# EAGLE design R303D (EAGLE 6.6.0)
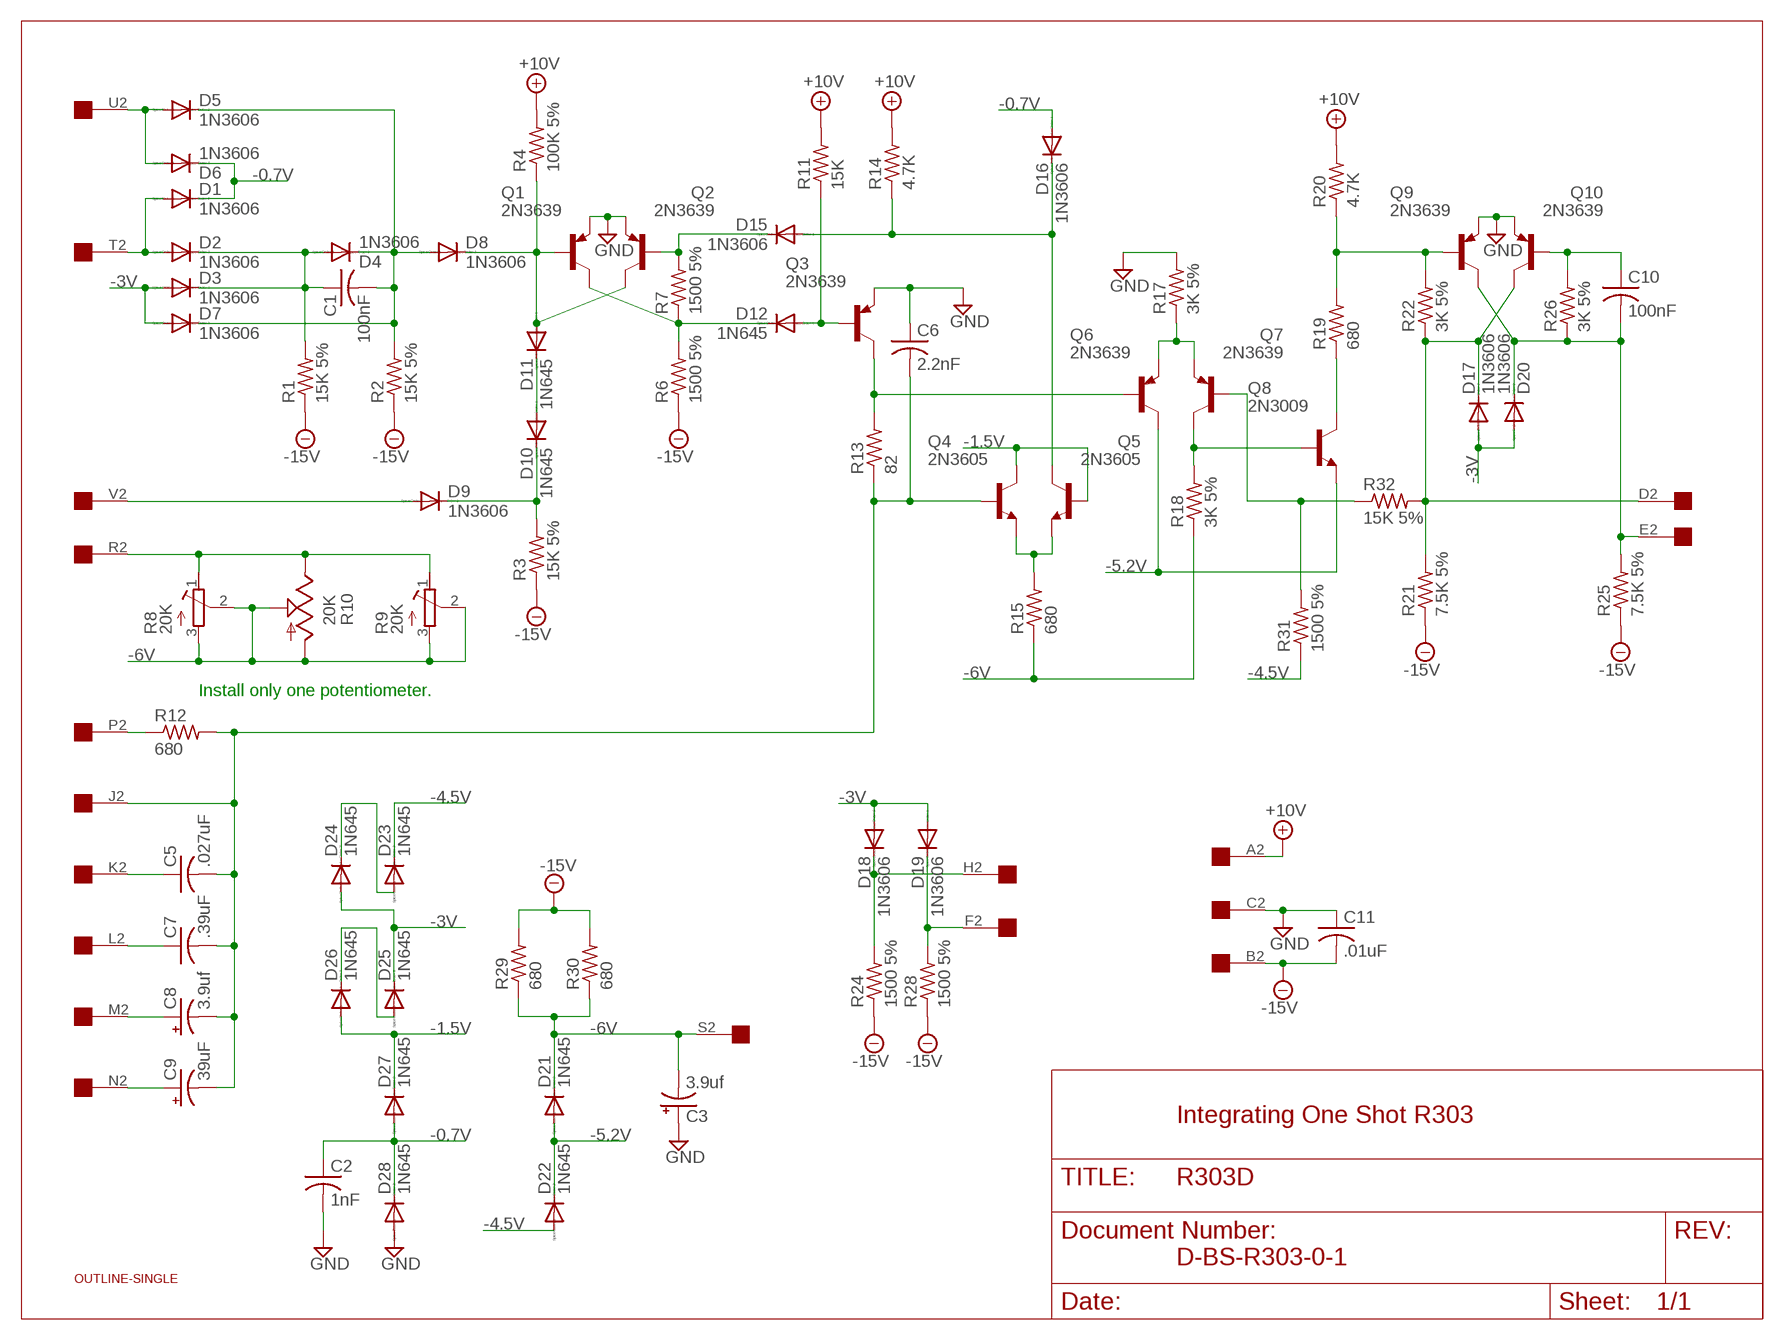
[diagram p0: schematic, sheet 1]

## Parts
C1  100nF  C-US075-032X103  [C075-032X103]
C2  1nF  C-US050-025X075  [C050-025X075]
C3  3.9uf  CPOL-USE12-4AXIAL  [E12-4]
C5  .027uF  C-US225-062X268  [C225-062X268]
C6  2.2nF  C-US050-025X075  [C050-025X075]
C7  .39uF  C-US325-137X374  [C325-137X374]
C8  3.9uf  CPOL-USE12-4AXIAL  [E12-4]
C9  39uF  CPOL-USE15-5AXIAL  [E15-5]
C10  100nF  C-US075-032X103  [C075-032X103]
C11  .01uF  C-US075-032X103  [C075-032X103]
D1  1N3606  1N4148DO35-10  [DO35-10]
D2  1N3606  1N4148DO35-10  [DO35-10]
D3  1N3606  1N4148DO35-10  [DO35-10]
D4  1N3606  1N4148DO35-10  [DO35-10]
D5  1N3606  1N4148DO35-10  [DO35-10]
D6  1N3606  1N4148DO35-10  [DO35-10]
D7  1N3606  1N4148DO35-10  [DO35-10]
D8  1N3606  1N4148DO35-10  [DO35-10]
D9  1N3606  1N4148DO35-10  [DO35-10]
D10  1N645  1N4148DO35-10  [DO35-10]
D11  1N645  1N4148DO35-10  [DO35-10]
D12  1N645  1N4148DO35-10  [DO35-10]
D15  1N3606  1N4148DO35-10  [DO35-10]
D16  1N3606  1N4148DO35-10  [DO35-10]
D17  1N3606  1N4148DO35-10  [DO35-10]
D18  1N3606  1N4148DO35-10  [DO35-10]
D19  1N3606  1N4148DO35-10  [DO35-10]
D20  1N3606  1N4148DO35-10  [DO35-10]
D21  1N645  1N4148DO35-10  [DO35-10]
D22  1N645  1N4148DO35-10  [DO35-10]
D23  1N645  1N4148DO35-10  [DO35-10]
D24  1N645  1N4148DO35-10  [DO35-10]
D25  1N645  1N4148DO35-10  [DO35-10]
D26  1N645  1N4148DO35-10  [DO35-10]
D27  1N645  1N4148DO35-10  [DO35-10]
D28  1N645  1N4148DO35-10  [DO35-10]
Q1  2N3639  2N2904  [TO39]
Q2  2N3639  2N2904  [TO39]
Q3  2N3639  2N2904  [TO39]
Q4  2N3605  2N2102  [TO5]
Q5  2N3605  2N2102  [TO5]
Q6  2N3639  2N2904  [TO39]
Q7  2N3639  2N2904  [TO39]
Q8  2N3009  2N2102  [TO5]
Q9  2N3639  2N2904  [TO39]
Q10  2N3639  2N2904  [TO39]
R1  15K 5%  R-US_0207/10  [0207/10]
R2  15K 5%  R-US_0207/10  [0207/10]
R3  15K 5%  R-US_0207/10  [0207/10]
R4  100K 5%  R-US_0207/10  [0207/10]
R6  1500 5%  R-US_0207/10  [0207/10]
R7  1500 5%  R-US_0207/10  [0207/10]
R8  20K  R-TRIMM43P  [RTRIM43P]
R9  20K  275P  [3006Y]
R10  20K  TRIM_US-B25P  [B25P]
R11  15K  R-US_0207/10  [0207/10]
R12  680  R-US_0207/10  [0207/10]
R13  82  R-US_0207/10  [0207/10]
R14  4.7K  R-US_0207/10  [0207/10]
R15  680  R-US_0207/10  [0207/10]
R17  3K 5%  R-US_0207/10  [0207/10]
R18  3K 5%  R-US_0207/10  [0207/10]
R19  680  R-US_0207/10  [0207/10]
R20  4.7K  R-US_0207/10  [0207/10]
R21  7.5K 5%  R-US_0207/10  [0207/10]
R22  3K 5%  R-US_0207/10  [0207/10]
R24  1500 5%  R-US_0207/10  [0207/10]
R25  7.5K 5%  R-US_0207/10  [0207/10]
R26  3K 5%  R-US_0207/10  [0207/10]
R28  1500 5%  R-US_0207/10  [0207/10]
R29  680  R-US_0207/10  [0207/10]
R30  680  R-US_0207/10  [0207/10]
R31  1500 5%  R-US_0207/10  [0207/10]
R32  15K 5%  R-US_0207/10  [0207/10]
U$1  OUTLINE-SINGLE  [SINGLE]
U$2  EDGE-1  [EDGE-CON1]

## Nets
+10V [Supply]: R4.2 R11.2 R14.2 R20.2 U$2.A2
-0.7V: C2.1 D1.C D6.C D16.A D27.A D28.C
-1.5V [Supply]: D26.A D27.C Q4.3(C) Q5.2(B)
-3V [Supply]: D3.A D7.A D17.A D18.A D19.A D20.A D24.A D25.C
-4.5V [Supply]: D22.A D23.C R31.1
-5.2V [Supply]: D21.A D22.C Q6.3(C) Q8.1(E)
-6V: C3.- D21.C R8.2(S) R8.3(A) R9.2(S) R9.3(E) R10.A R10.S R15.1 R18.1 R29.1 R30.1 U$2.S2
-15V [Supply]: C11.2 R1.1 R2.1 R3.1 R6.1 R21.1 R24.1 R25.1 R28.1 R29.2 R30.2 U$2.B2
GND [Supply]: C2.2 C3.+ C6.1 C11.1 D28.A Q1.1(E) Q2.1(E) Q3.1(E) Q9.1(E) Q10.1(E) R17.2 U$2.C2
N$1: D1.A D2.A U$2.T2
N$2: C1.1 D2.C D3.C D4.A R1.2
N$3: D5.A D6.A U$2.U2
N$4: C1.2 D4.C D5.C D7.C D8.A R2.2
N$5: D8.C D11.A Q1.2(B) Q2.3(C) R4.1
N$6: D12.C Q1.3(C) R6.2 R7.1
N$7: D15.C Q2.2(B) R7.2
N$8: D9.C D10.C R3.2
N$9: D10.A D11.C
N$10: D9.A U$2.V2
N$11: D12.A Q3.2(B) R11.1
N$12: R8.1(E) R9.1(A) R10.E U$2.R2
N$13: C9.+ U$2.N2
N$14: C8.+ U$2.M2
N$15: C7.1 U$2.L2
N$16: C5.1 U$2.K2
N$17: C5.2 C6.2 C7.2 C8.- C9.- Q4.2(B) R12.2 R13.1 U$2.J2
N$18 [Supply]: D25.A D26.C
N$19 [Supply]: D23.A D24.C
N$21: Q3.3(C) Q6.2(B) R13.2
N$22: R12.1 U$2.P2
N$23: Q6.1(E) Q7.1(E) R17.1
N$24: Q4.1(E) Q5.1(E) R15.2
N$25: Q7.3(C) Q8.2(B) R18.2
N$26: D15.A D16.C Q5.3(C) R14.1
N$27: Q9.2(B) R19.2 R20.1 R22.2
N$28: Q8.3(C) R19.1
N$29: D17.C Q10.3(C) R21.2 R22.1 R32.2 U$2.D2
N$30: C10.2 D20.C Q9.3(C) R25.2 R26.1 U$2.E2
N$31: C10.1 Q10.2(B) R26.2
N$32: D18.C R24.2 U$2.H2
N$33: D19.C R28.2 U$2.F2
N$34: Q7.2(B) R31.2 R32.1

## Notes on the sheet
- Install only one potentiometer.
- Integrating One Shot R303
- D-BS-R303-0-1

## Library data of the parts
C1 C2 C5-C7 C10 C11 = rcl:C-US: CAPACITOR, American symbol
C3 C8 = dec-con:CPOL-USE12-4AXIAL: 0.5" veresion of an electrolytic
C9 = rcl:CPOL-US: POLARIZED CAPACITOR, American symbol
D1-D12 D15-D28 = diode:1N4148: DIODE high speed (Philips)
Q1-Q3 Q6 Q7 Q9 Q10 = transistor-pnp:2N2904*: PNP Transistror
Q4 Q5 Q8 = transistor-npn:2N2102: NPN Transistor
R1-R4 R6 R7 R11-R15 R17-R22 R24-R26 R28-R32 = rcl:R-US_: RESISTOR, American symbol
R8 = rcl:R-TRIMM: Trimm resistor
R9 = dec-con:275P: Trimpot with 275P (3006Y) footprint.
R10 = pot:TRIM_US-: POTENTIOMETER
U$1 = dec-con:OUTLINE-*: Board outlines for DEC boards.
U$2 = dec-con:EDGE-1: Single-Sided DEC Edge Connector -- (side 2)

## Net classes
1 Supply: width 0.813 mm

## Board
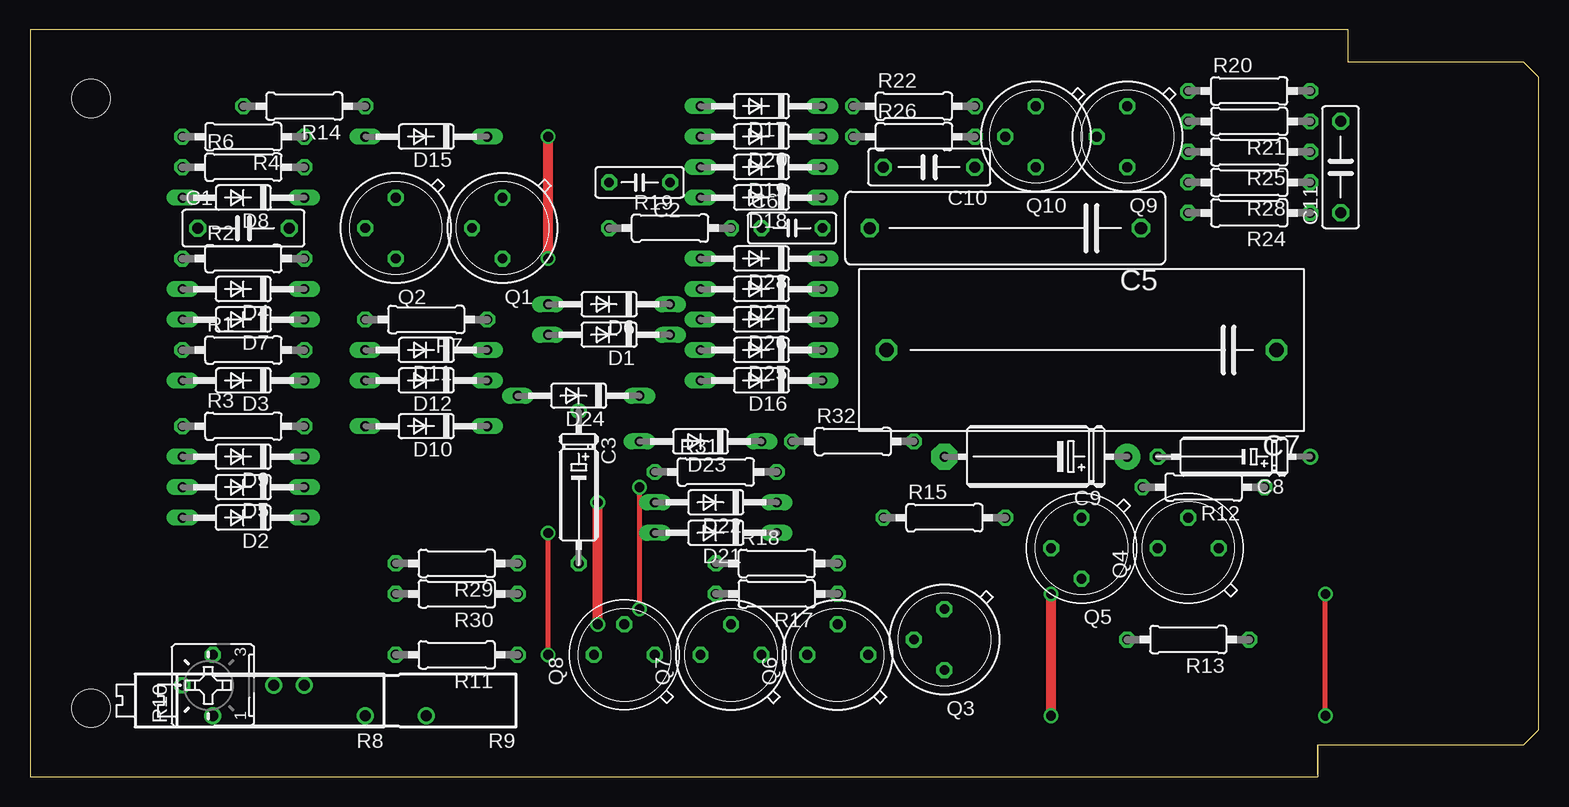
[diagram p1: board, top side]
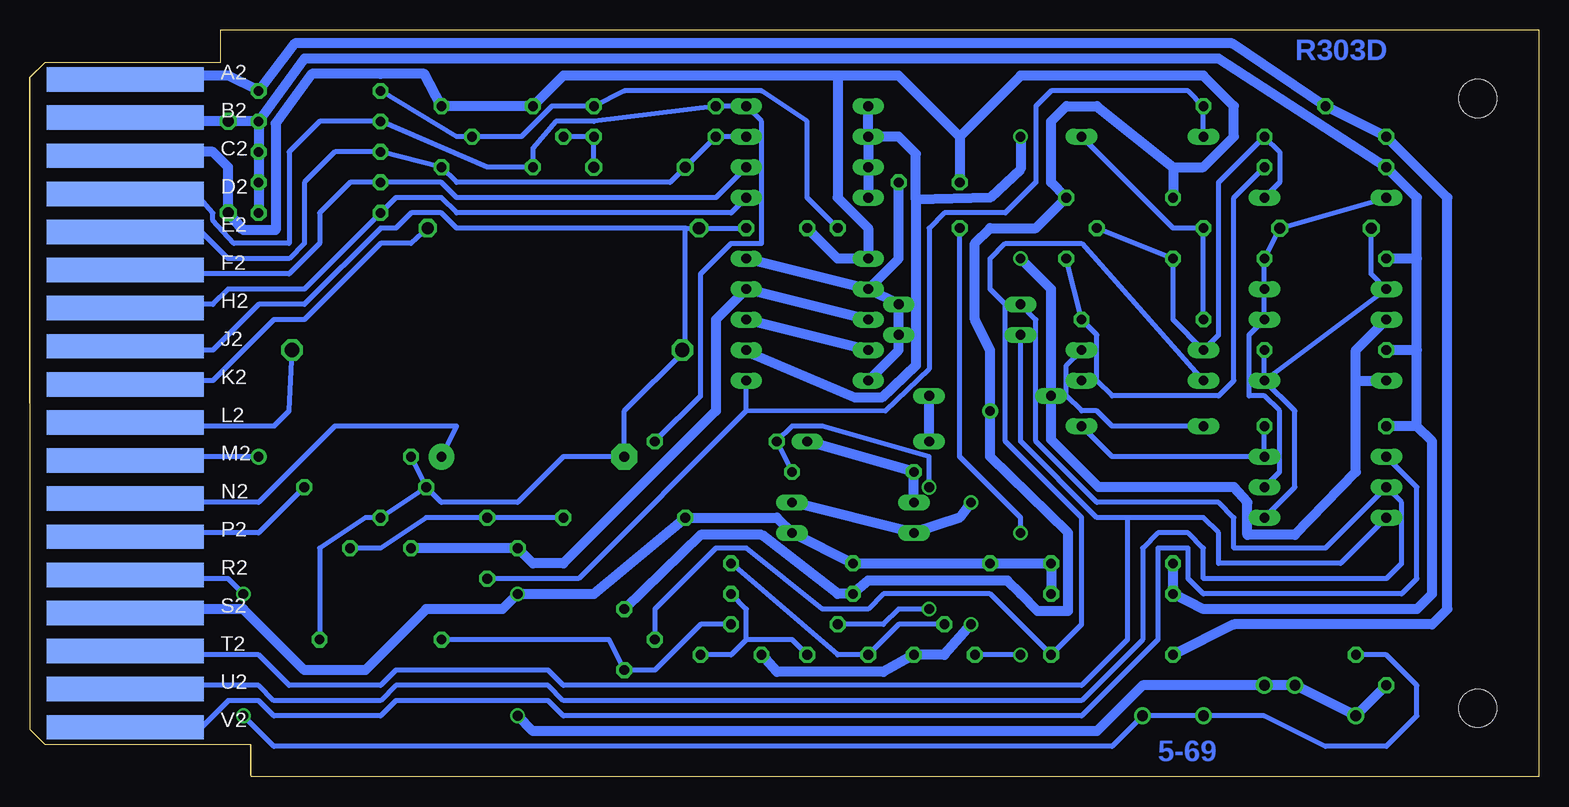
[diagram p2: board, bottom side, seen from below]

Size 125.73 x 62.23 mm. Coordinates in mm from the lower left corner, seen from the top.
Copper layers (1+16): Top 0.035mm / dielectric 1.5mm / Bottom 0.035mm
Design rules "16mils": minimum track width 16mil, minimum drill 32mil, track to track 15mil, track to pad 10mil, pad to pad 10mil, via to via 10mil, smd to smd 10mil, copper to edge 13mil, drill to drill 10mil, minimum pad ring 10mil, minimum via ring 8mil, stop-mask expansion 0mil, vias tented up to drill 0mil, thermal gap 10mil

### Footprints (pad centres in the part's own frame; a part is rotated, then mirrored left to right if it is on the bottom)
C075-032X103 = drill 0.914 octagon: 1 -3.81,0; 2 3.81,0
C050-025X075 = drill 0.813 octagon: 1 -2.54,0; 2 2.54,0
E12-4 = drill 0.813: + -7.62,0 | drill 0.813 octagon: - 5.08,0
C225-062X268 = drill 1.016 octagon: 1 -11.303,0; 2 11.303,0
C325-137X374 = drill 1.194 octagon: 1 -16.256,0; 2 16.256,0
E15-5 = drill 0.813 pad 2.159: + -7.62,0 | drill 0.813 pad 2.159 octagon: - 7.62,0
DO35-10 = drill 0.813 long: A 5.08,0; C -5.08,0
TO39 = drill 0.813 octagon: 1 0,-2.54; 2 2.54,0; 3 0,2.54
TO5 = drill 0.813 octagon: 1 0,-2.54; 2 2.54,0; 3 0,2.54
0207/10 = drill 0.813 octagon: 1 -5.08,0; 2 5.08,0
RTRIM43P = drill 0.9: 1 -7.62,1.27; 2 0,-1.27; 3 5.08,1.27
3006Y = drill 0.9: 1 -8.89,1.27; 2 1.27,-1.27; 3 8.89,1.27
B25P = drill 0.813 octagon: A -2.54,0; E 2.54,0; S 0,2.54
SINGLE = hole 3.175: 120.65,56.515; 120.65,5.715
EDGE-CON1 = smd 13.106 x 2.032 bottom: A2 7.938,4.128; B2 7.938,7.303; C2 7.938,10.477; D2 7.938,13.652; E2 7.938,16.828; F2 7.938,20.003; H2 7.938,23.177; J2 7.938,26.352; K2 7.938,29.527; L2 7.938,32.703; M2 7.938,35.877; N2 7.938,39.053; P2 7.938,42.227; R2 7.938,45.403; S2 7.938,48.578; T2 7.938,51.752; U2 7.938,54.928; V2 7.938,58.102

### Placement (x,y rotation side)
C1  17.78,45.72 0 top
C2  50.8,49.53 180 top
C3  45.72,22.86 270 top
C5  81.28,45.72 180 top
C6  63.5,45.72 0 top
C7  87.63,35.56 180 top
C8  99.06,26.67 180 top
C9  83.82,26.67 180 top
C10  74.93,50.8 180 top
C11  109.22,50.8 90 top
D1  48.26,36.83 180 top
D2  17.78,21.59 180 top
D3  17.78,33.02 180 top
D4  17.78,40.64 180 top
D5  17.78,24.13 180 top
D6  48.26,39.37 180 top
D7  17.78,38.1 180 top
D8  17.78,48.26 180 top
D9  17.78,26.67 180 top
D10  33.02,29.21 180 top
D11  33.02,35.56 180 top
D12  33.02,33.02 180 top
D15  33.02,53.34 180 top
D16  60.96,33.02 180 top
D17  60.96,55.88 180 top
D18  60.96,48.26 180 top
D19  60.96,50.8 180 top
D20  60.96,53.34 180 top
D21  57.15,20.32 180 top
D22  57.15,22.86 180 top
D23  55.88,27.94 180 top
D24  45.72,31.75 180 top
D25  60.96,35.56 180 top
D26  60.96,38.1 180 top
D27  60.96,40.64 180 top
D28  60.96,43.18 180 top
Q1  39.37,45.72 180 top
Q2  30.48,45.72 180 top
Q3  76.2,11.43 180 top
Q4  96.52,19.05 90 top
Q5  87.63,19.05 180 top
Q6  67.31,10.16 90 top
Q7  58.42,10.16 90 top
Q8  49.53,10.16 90 top
Q9  91.44,53.34 180 top
Q10  83.82,53.34 180 top
R1  17.78,35.56 0 top
R2  17.78,43.18 0 top
R3  17.78,29.21 0 top
R4  17.78,53.34 180 top
R6  17.78,50.8 0 top
R7  33.02,38.1 180 top
R8  20.32,6.35 180 top
R9  24.13,6.35 180 top
R10  15.24,7.62 90 top
R11  35.56,10.16 180 top
R12  97.79,24.13 180 top
R13  96.52,11.43 180 top
R14  22.86,55.88 180 top
R15  76.2,21.59 0 top
R17  62.23,15.24 180 top
R18  62.23,17.78 0 top
R19  53.34,45.72 0 top
R20  101.6,57.15 0 top
R21  101.6,54.61 180 top
R22  73.66,55.88 0 top
R24  101.6,46.99 180 top
R25  101.6,52.07 180 top
R26  73.66,53.34 0 top
R28  101.6,49.53 180 top
R29  35.56,17.78 180 top
R30  35.56,15.24 180 top
R31  57.15,25.4 0 top
R32  68.58,27.94 0 top
U$1  125.73,62.23 180 top
U$2  125.73,62.23 180 top

### Tracks (layer width: path | path; a pad name or v marks a point on that pad's centre or on a via)
+10V
  Bottom 0.813: U$2.A2 115.57,58.42 109.22,58.42 R20.2 103.66,61.12 25.56,61.12 R14.2 R4.2 7.62,48.26 7.62,13.97 8.89,12.7 25.4,12.7 R11.2
-0.7V
  Bottom 0.813: D27.A D6.C D1.C 53.34,35.56 D16.A | D27.A D28.C | D27.A 53.34,43.18 C2.1
-1.5V
  Bottom 0.813: Q4.3 Q5.2 83.82,17.78 81.28,17.78 68.58,30.48 68.58,38.1 D27.C D26.A
-3V  (via drill 0.81)
  Top 0.813: v43.18,43.18 v43.18,53.34
  Bottom 0.813: 15.24,25.4 15.24,35.56 D7.A | 15.24,25.4 15.24,33.02 D3.A | 15.24,25.4 20.32,20.16 24.29,20.16 24.29,22.86 25.4,24.13 36.67,24.13 40.64,28.1 D24.A 40.64,40.64 v43.18,43.18 | v43.18,53.34 43.18,50.64 45.72,48.26 51.91,48.1 | 51.91,48.1 51.91,51.91 53.34,53.34 D20.A | D20.A D17.A | 51.91,48.1 51.91,34.29 54.77,31.59 56.99,31.59 66.04,35.4 D25.C | D20.A D19.A D18.A
-4.5V
  Bottom 0.813: D22.A R31.1 D23.C
-5.2V  (via drill 0.81)
  Top 0.813: v47.31,12.7 v47.31,22.86
  Bottom 0.813: Q6.3 63.5,8.73 54.61,8.73 Q8.1 49.53,10.16 v47.31,12.7 | D22.C D21.A 48.26,21.59 v47.31,22.86
-6V  (via drill 0.81)
  Top 0.813: v85.09,5.08 v85.09,15.24
  Bottom 0.813: U$2.S2 116.84,13.97 107.95,13.97 102.87,8.89 97.79,8.89 92.71,13.97 86.36,13.97 v85.09,15.24 78.74,15.24 R15.1 63.5,21.59 D21.C R18.1 C3.- R29.1 | v85.09,5.08 83.82,3.81 36.83,3.81 33.02,7.62 R9.2 R8.2 R10.A R10.S | R29.1 R30.1 R29.1
-15V
  Bottom 0.813: U$2.B2 116.84,54.61 C11.2 R21.1 | R21.1 102.87,59.85 26.67,59.85 R6.1 10.16,48.26 10.16,43.18 | R21.1 R25.1 | R25.1 R28.1 | R28.1 R24.1 | R21.1 R25.1 | R25.1 R28.1 | 10.16,43.18 R2.1 | 10.16,35.56 10.16,43.18 | 10.16,29.21 8.89,27.94 8.89,15.24 10.16,13.97 27.94,13.97 R30.2 R29.2 | 10.16,29.21 10.16,35.56 | 10.16,35.56 R1.1 | 10.16,29.21 R3.1
GND
  Bottom 0.813: U$2.C2 116.84,52.07 110.49,52.07 109.22,50.8 C11.1 107.95,45.56 105.25,45.56 105.25,54.45 102.23,58.58 96.52,58.58 92.87,58.58 Q9.1 Q10.1 81.28,58.42 58.42,58.42 | Q3.1 69.85,20.16 64.77,20.16 58.42,15.24 R17.2 55.88,16.35 44.29,16.35 43.18,15.24 41.75,13.81 39.21,13.81 39.21,20.32 45.72,26.67 C3.+ 45.72,35.56 46.99,38.1 46.99,44.45 45.72,45.72 41.91,45.72 Q1.1 40.64,49.53 40.64,54.61 39.37,55.88 36.83,55.88 30.48,50.8 | 30.48,50.8 Q2.1 | 30.48,50.8 27.94,50.8 25.4,53.34 25.4,55.88 27.94,58.42 43.18,58.42 48.26,53.34 | 48.26,53.34 C2.2 | 58.42,58.42 53.34,58.42 48.26,53.34 | C6.1 58.42,43.18 D28.A 55.88,45.72 58.42,48.26 58.42,58.42
N$1
  Bottom 0.406: U$2.T2 116.84,10.16 106.68,10.16 104.14,7.62 96.52,7.62 95.25,8.89 82.55,8.89 81.28,7.62 38.1,7.62 34.29,11.43 34.29,21.59 | 34.29,21.59 27.94,21.59 26.67,20.32 26.67,17.78 16.51,17.78 D2.A | 34.29,21.59 36.83,21.59 43.18,27.94 D1.A
N$2
  Bottom 0.406: C1.1 13.97,41.91 D4.A D3.C | D3.C R1.2 | D2.C 20.32,24.13 20.32,30.48 D3.C
N$3
  Bottom 0.406: U$2.U2 116.84,7.62 106.68,7.62 105.41,6.35 96.52,6.35 95.25,7.62 82.55,7.62 81.28,6.35 38.1,6.35 33.02,11.43 33.02,19.05 31.75,20.32 29.21,20.32 27.94,19.05 27.94,16.51 12.7,16.51 11.43,17.78 11.43,22.86 D5.A 17.78,19.05 25.4,19.05 25.4,21.59 26.67,22.86 36.83,22.86 41.91,27.94 41.91,38.1 D6.A
N$4
  Bottom 0.406: D8.A C1.2 R2.2 D4.C D7.C 24.13,36.83 24.13,31.75 22.86,31.75 21.59,30.48 21.59,25.4 D5.C
N$5
  Bottom 0.406: D8.C 21.59,49.53 21.59,52.07 R4.1 26.67,49.53 26.67,36.83 D11.A 30.48,38.1 Q2.3 Q1.2
N$6
  Bottom 0.406: R6.2 25.4,48.26 25.4,33.02 26.67,31.75 35.56,31.75 36.83,33.02 | Q1.3 R7.1 36.83,36.83 36.83,33.02 | 36.83,33.02 D12.C
N$7
  Bottom 0.406: R7.2 Q2.2 30.48,45.72 D15.C
N$8
  Bottom 0.406: R3.2 D9.C 35.56,26.67 D10.C
N$9
  Bottom 0.406: D11.C 39.37,34.29 39.37,31.75 38.1,30.48 36.83,30.48 35.56,29.21 D10.A
N$10
  Bottom 0.406: U$2.V2 116.84,3.81 111.76,3.81 109.22,6.35 106.68,6.35 105.41,5.08 96.52,5.08 95.25,6.35 82.55,6.35 81.28,5.08 38.1,5.08 31.75,11.43 31.75,19.05 29.21,19.05 29.21,16.51 27.94,15.24 11.43,15.24 10.16,16.51 10.16,24.13 D9.A
N$11
  Bottom 0.406: Q3.2 73.66,13.97 68.58,19.05 66.04,19.05 59.69,13.97 55.88,13.97 54.61,15.24 45.72,15.24 R11.1 38.1,12.7 38.1,21.59 44.45,27.94 44.45,39.37 45.72,40.64 45.72,43.18 44.45,44.45 38.1,44.45 D12.A
N$12  (via drill 0.81)
  Top 0.406: v107.95,5.08 v107.95,15.24
  Bottom 0.406: U$2.R2 116.84,16.51 109.22,16.51 v107.95,15.24 | v107.95,5.08 105.41,2.54 35.56,2.54 R9.1 R8.1 22.86,5.08 17.78,2.54 12.7,2.54 10.16,5.08 10.16,7.62 12.7,10.16 R10.E
N$13
  Bottom 0.406: U$2.N2 116.84,22.86 106.68,22.86 100.33,29.21 90.17,29.21 C9.+
N$14
  Bottom 0.406: U$2.M2 116.84,26.67 C8.+
N$15
  Bottom 0.406: U$2.L2 116.84,29.21 105.41,29.21 104.14,30.48 C7.1
N$16
  Bottom 0.406: U$2.K2 116.84,33.02 110.49,33.02 105.41,38.1 102.87,38.1 96.52,44.45 93.98,44.45 C5.1
N$17
  Bottom 0.406: U$2.J2 116.84,35.56 110.49,35.56 106.68,39.37 102.87,39.37 96.52,45.72 95.25,45.72 93.98,46.99 91.44,46.99 90.17,45.72 71.12,45.72 | 69.85,45.72 C5.2 | 71.12,35.56 C7.2 | 71.12,35.56 71.12,45.72 | 71.12,45.72 69.85,45.72 | 71.12,35.56 76.2,30.48 C9.- 81.28,26.67 85.09,22.86 91.44,22.86 R12.2 | R12.2 C8.- | R12.2 Q4.2 97.79,21.59 101.6,19.05 R13.1 | 69.85,45.72 C6.2
N$18
  Bottom 0.813: D25.A D26.C
N$19
  Bottom 0.813: D23.A D24.C
N$21
  Bottom 0.406: R13.2 77.47,11.43 Q3.3 73.66,8.89 69.85,12.7 Q6.2
N$22
  Bottom 0.406: U$2.P2 116.84,20.32 106.68,20.32 R12.1
N$23
  Bottom 0.406: Q6.1 67.31,10.16 66.04,11.43 | 66.04,11.43 66.04,13.97 R17.1 | Q7.1 62.23,11.43 66.04,11.43
N$24
  Bottom 0.406: Q4.1 96.52,19.05 92.71,21.59 Q5.1 R15.2
N$25
  Bottom 0.406: Q8.2 53.34,12.7 Q7.3 58.42,10.16 R18.2
N$26
  Bottom 0.406: Q5.3 80.01,16.51 66.04,30.48 | D15.A R14.1 29.21,57.15 40.64,57.15 41.91,55.88 41.91,49.53 44.45,46.99 49.53,46.99 50.8,45.72 50.8,33.97 54.45,30.48 66.04,30.48 | 66.04,30.48 D16.C
N$27
  Bottom 0.406: R20.1 90.17,53.34 Q9.2 84.77,53.34 82.23,55.88 R22.2 76.2,57.15 64.77,57.15 60.96,54.61 60.96,48.26 R19.2
N$28  (via drill 0.81)
  Top 0.406: v43.18,10.16 v43.18,20.32
  Bottom 0.406: v43.18,10.16 Q8.3 | v43.18,20.32 43.18,21.59 48.26,26.67 R19.1
N$29
  Bottom 0.406: U$2.D2 116.84,48.26 111.6,48.26 110.49,46.99 110.49,46.35 108.74,44.45 104.14,44.45 104.14,52.07 101.6,54.61 R21.2 87.63,50.8 Q10.3 83.82,52.39 81.92,54.61 78.74,54.61 R22.1 D17.C 64.77,54.61 64.77,44.45 67.31,44.45 69.85,41.91 69.85,31.75 R32.2
N$30
  Bottom 0.406: U$2.E2 116.84,45.72 111.76,45.72 109.22,43.18 104.14,43.18 102.87,44.45 102.87,49.53 100.33,52.07 R25.2 Q9.3 90.17,49.53 72.39,49.53 C10.2 R26.1 D20.C
N$31
  Bottom 0.406: Q10.2 R26.2 C10.1
N$32
  Bottom 0.406: U$2.H2 116.84,39.37 110.49,39.37 109.22,40.64 102.87,40.64 R24.2 95.25,48.26 91.44,48.26 90.17,46.99 67.31,46.99 D18.C
N$33
  Bottom 0.406: U$2.F2 116.84,41.91 104.14,41.91 101.6,44.45 101.6,46.99 99.06,49.53 R28.2 91.44,49.53 90.17,48.26 68.58,48.26 D19.C
N$34  (via drill 0.81)
  Top 0.406: v50.8,13.97 v50.8,24.13
  Bottom 0.406: Q7.2 54.61,12.7 53.34,13.97 v50.8,13.97 | v50.8,24.13 50.8,26.67 59.69,29.21 62.23,29.21 R32.1 R31.2

### Text on the board
Bottom: R303D | 5-69